# Altium project pt100_project.PrjPcb
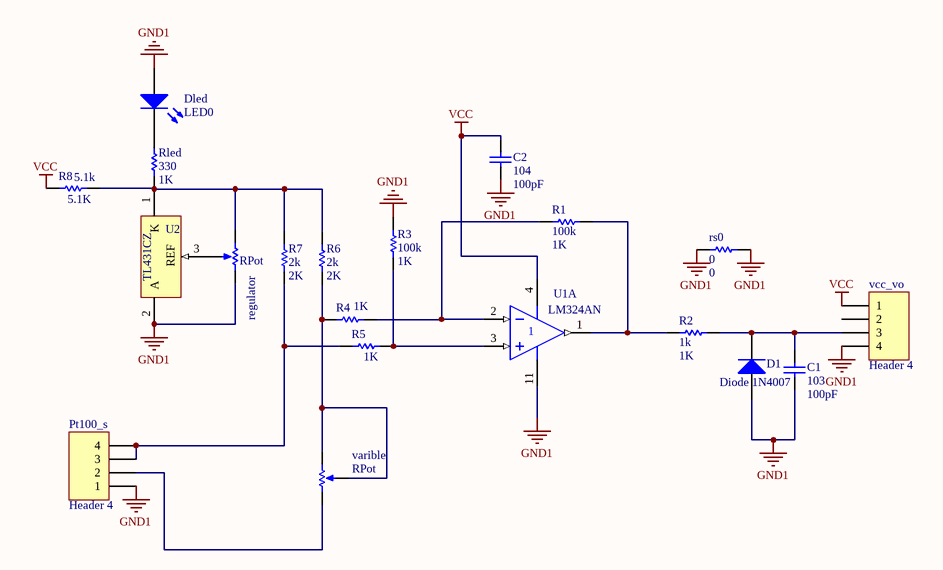
[diagram p0: pt100_shc.SchDoc]
1 sheet, 20 parts. Net scope: global (net labels, ports and power ports of the same name join across sheets).
Board file: pt100_pcb.PcbDoc

## Sheet pt100_shc.SchDoc
size A4; PageSetup: Record=PageOptions|CenterHorizontal=True|CenterVertical=True|PrintScale=0.97|XCorrection=1.00|YCorrection=1.00|PrintKind=1|BorderSize=5000000|LeftOffset=0|BottomOffset=0|Orientation=2|PaperLength=2970|PaperWidth=2100|Scale=100|PaperSource=4|PrintQuality=600|MediaType=1|DitherType=10|PaperKind=A4|PrintScaleMode=1

### Parts
C1  103  value 100pF  [RAD-0.1]
C2  104  value 100pF  [RAD-0.1]
D1  Diode 1N4007  [DIO10.46-5.3x2.8]
Dled  LED0  [CE6]
Pt100_s  Header 4  [HDR1X4]
R1  100k  value 1K  [AXIAL-0.3]
R2  1k  [AXIAL-0.3]
R3  100k  value 1K  [AXIAL-0.3]
R4  1k  [AXIAL-0.3]
R5  1k  [AXIAL-0.3]
R6  2k  [AXIAL-0.3]
R7  2k  [AXIAL-0.3]
R8  5.1k  [AXIAL-0.3]
regulator  RPot  [VR5]
Rled  330  value 1K  [AXIAL-0.3]
rs0  0  [AXIAL-0.3]
U1  LM324AN  [N014]  (part A of 4)
U2  TL431CZ  [TO92]
varible  RPot  [VR5]
vcc_vo  Header 4  [HDR1X4]

### Nets
GND1: C1.1 C2.1 D1.1(A) Dled.1(A) Pt100_s.1 R3.2 regulator.2(BOT) rs0.1 rs0.2 U1.11(V-) U2.2(A) vcc_vo.4
VCC: C2.2 R8.1 U1.4(V+) vcc_vo.1
NetC1_2: C1.2 D1.2(K) R2.2 vcc_vo.3
NetDled_2: Dled.2(K) Rled.2
NetPt100_s_2: Pt100_s.2 varible.1(TOP)
NetPt100_s_3: Pt100_s.3 Pt100_s.4 R5.1 R7.1
NetR1_1: R1.1 R4.2 U1.2(IN-)
NetR1_2: R1.2 R2.1 U1.1(OUT)
NetR3_1: R3.1 R5.2 U1.3(IN+)
NetR4_1: R4.1 R6.1 varible.2(BOT) varible.3(TAP)
NetR6_2: R6.2 R7.2 R8.2 regulator.1(TOP) Rled.1 U2.1(K)
Netregulator_3: regulator.3(TAP) U2.3(REF)

Not connected (* = marked no-connect by the designer): vcc_vo 2

### Library data of the parts
C1 C2 = Cap: Capacitor; Published: 8-Jun-2000; LatestRevisionDate: 17-Jul-2002; LatestRevisionNote: Re-released for DXP Platform.; PackageReference: RAD-0.3; Publisher: Altium Limited
D1 = Diode 1N4007: 1 Amp General Purpose Rectifier; Published: 8-Jun-2000; LatestRevisionDate: 17-Jul-2002; LatestRevisionNote: Re-released for DXP Platform.; DatasheetVersion: 1998; PackageVersion: Aug-1999; PackageReference: DO-41; Publisher: Altium Limited; Code_JEDEC: DO-204-AL; ComponentLink1Description: Manufacturer Link; ComponentLink1URL: http://www.fairchildsemi.com/; ComponentLink2Description: Datasheet; ComponentLink2URL: http://www.fairchildsemi.com/ds/1N%2F1N4001.pdf
Dled = LED0: Typical INFRARED GaAs LED; Published: 8-Jun-2000; LatestRevisionDate: 08-Jul-2005; LatestRevisionNote: Mech Layer 1 removed.; PackageReference: LED-0; Publisher: Altium Limited
Pt100_s vcc_vo = Header 4: Header, 4-Pin; LatestRevisionDate: 17-Jul-2002; LatestRevisionNote: Re-released for DXP Platform.; Publisher: Altium Limited
R1-R8 Rled rs0 = Res1: Resistor; Published: 8-Jun-2000; LatestRevisionDate: 17-Jul-2002; LatestRevisionNote: Re-released for DXP Platform.; PackageReference: AXIAL-0.3; Publisher: Altium Limited
  R2 R4 R5: Value: 1K
  R6 R7: Value: 2K
  R8: Value: 5.1K
  rs0: Value: 0
regulator varible = RPot: Potentiometer; Sim Note: Enter the Resistance value and the set point into parameter fields.; Set Position: 0.5; Value: 1K; Published: 8-Jun-2000; LatestRevisionDate: 17-Jul-2002; LatestRevisionNote: Re-released for DXP Platform.; PackageReference: VR5; Publisher: Altium Limited
U1 = LM324AN: Quadruple Operational Amplifier; Published: 15-Apr-2002; LatestRevisionDate: 04-Mar-2005; LatestRevisionNote: Stylized 3D Model Added.; DatasheetVersion: Jan-1989; PackageVersion: Oct-1995; PackageReference: N014; Publisher: Altium Limited; PackageDescription: DIP; 14 Leads; Row Spacing 7.62 mm; Pitch 2.54 mm; ComponentLink1Description: Manufacturer Link; ComponentLink1URL: http://www.ti.com/; ComponentLink2Description: Datasheet; ComponentLink2URL: http://www-s.ti.com/sc/ds/lm324.pdf
U2 = TL431CZ: Programmable Voltage Reference; Published: 24-Aug-2001; LatestRevisionDate: 17-Jul-2002; LatestRevisionNote: Re-released for DXP Platform.; DatasheetVersion: Nov-1998; PackageReference: TO92; Publisher: Altium Limited; PackageDescription: TO, Flat Index; 3 In-Line, Axial Leads; Body Dia. 4.8mm; Leads 0.51 x 0.51 mm (max); ComponentLink1Description: Manufacturer Link; ComponentLink1URL: http://www.st.com/; ComponentLink2Description: Datasheet; ComponentLink2URL: http://www.st.com/stonline/products/literature/ds/4467/tl431.pdf